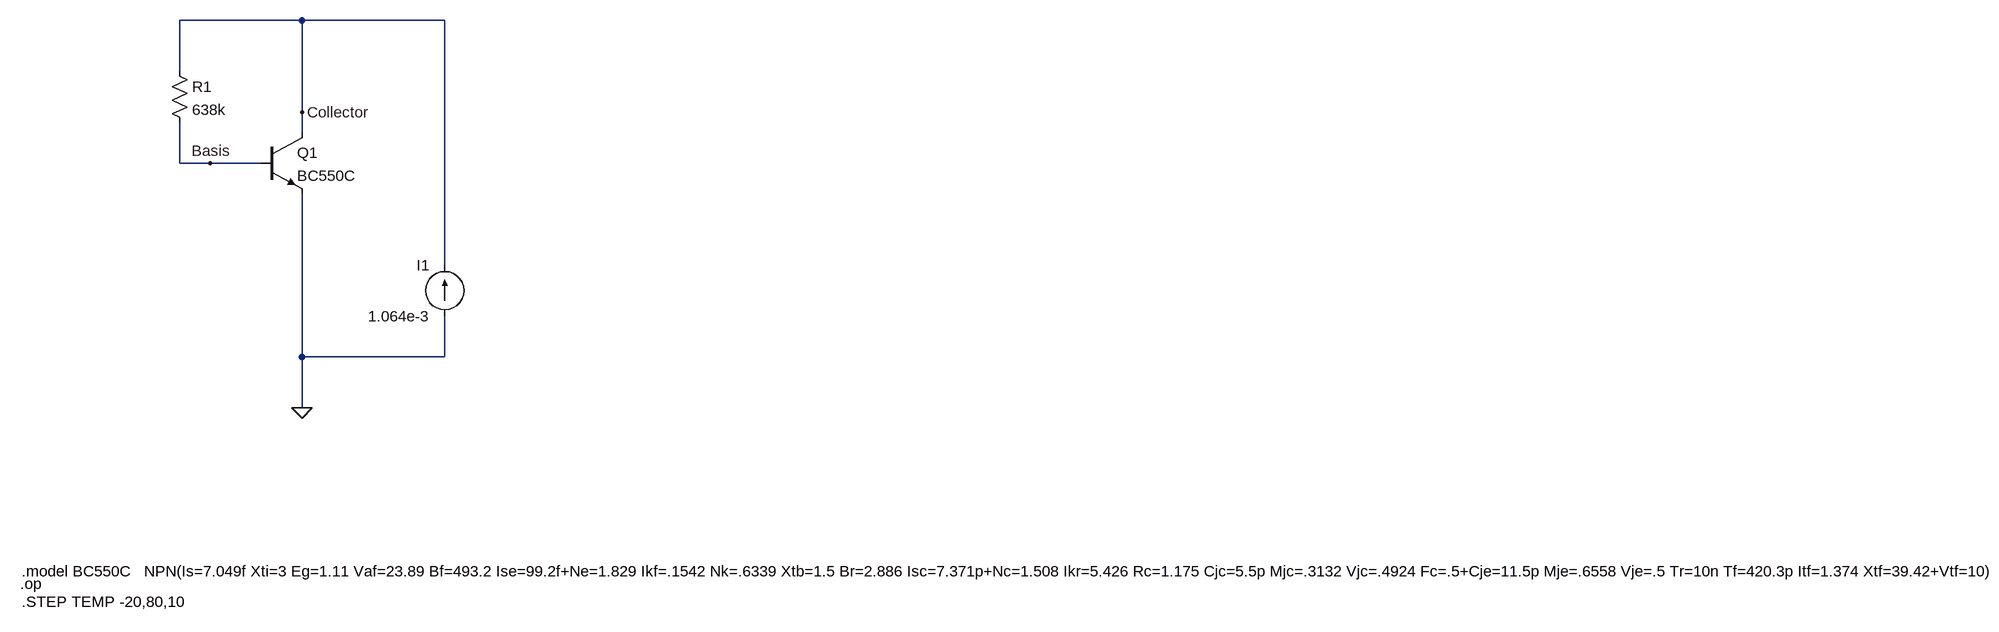
[diagram p0: schematic temp_sim.asc]
temp_sim.asc, the LTspice schematic file:
Version 4
SHEET 1 3456 680
WIRE 480 -624 288 -624
WIRE 704 -624 480 -624
WIRE 288 -544 288 -624
WIRE 480 -480 480 -624
WIRE 480 -448 480 -480
WIRE 288 -400 288 -464
WIRE 336 -400 288 -400
WIRE 416 -400 336 -400
WIRE 704 -240 704 -624
WIRE 480 -96 480 -352
WIRE 704 -96 704 -160
WIRE 704 -96 480 -96
WIRE 480 -16 480 -96
FLAG 480 -16 0
FLAG 336 -400 Basis
FLAG 480 -480 Collector
SYMBOL npn 416 -448 R0
SYMATTR InstName Q1
SYMATTR Value BC550C
SYMBOL current 704 -160 R180
WINDOW 0 24 80 Left 2
WINDOW 3 24 0 Left 2
WINDOW 123 0 0 Left 0
WINDOW 39 0 0 Left 0
SYMATTR InstName I1
SYMATTR Value 1.064e-3
SYMBOL res 272 -560 R0
SYMATTR InstName R1
SYMATTR Value 638k
TEXT 40 240 Left 2 !.model BC550C   NPN(Is=7.049f Xti=3 Eg=1.11 Vaf=23.89 Bf=493.2 Ise=99.2f+Ne=1.829 Ikf=.1542 Nk=.6339 Xtb=1.5 Br=2.886 Isc=7.371p+Nc=1.508 Ikr=5.426 Rc=1.175 Cjc=5.5p Mjc=.3132 Vjc=.4924 Fc=.5+Cje=11.5p Mje=.6558 Vje=.5 Tr=10n Tf=420.3p Itf=1.374 Xtf=39.42+Vtf=10)
TEXT 38 260 Left 2 !.op
TEXT 40 288 Left 2 !.STEP TEMP -20,80,10

The netlist it stands for:
* temp_sim.asc
Q1 Collector Basis 0 0 BC550C
I1 0 Collector 1.064e-3
R1 Collector Basis 638k
.model NPN NPN
.model PNP PNP
.lib standard.bjt
.model BC550C   NPN(Is=7.049f Xti=3 Eg=1.11 Vaf=23.89 Bf=493.2 Ise=99.2f+Ne=1.829 Ikf=.1542 Nk=.6339 Xtb=1.5 Br=2.886 Isc=7.371p+Nc=1.508 Ikr=5.426 Rc=1.175 Cjc=5.5p Mjc=.3132 Vjc=.4924 Fc=.5+Cje=11.5p Mje=.6558 Vje=.5 Tr=10n Tf=420.3p Itf=1.374 Xtf=39.42+Vtf=10)
.op
.STEP TEMP -20,80,10
.backanno
.end